# Altium schematic sheet PS_Acelerometro.SchDoc
size A4; SheetNumber: 1; SheetTotal: 1
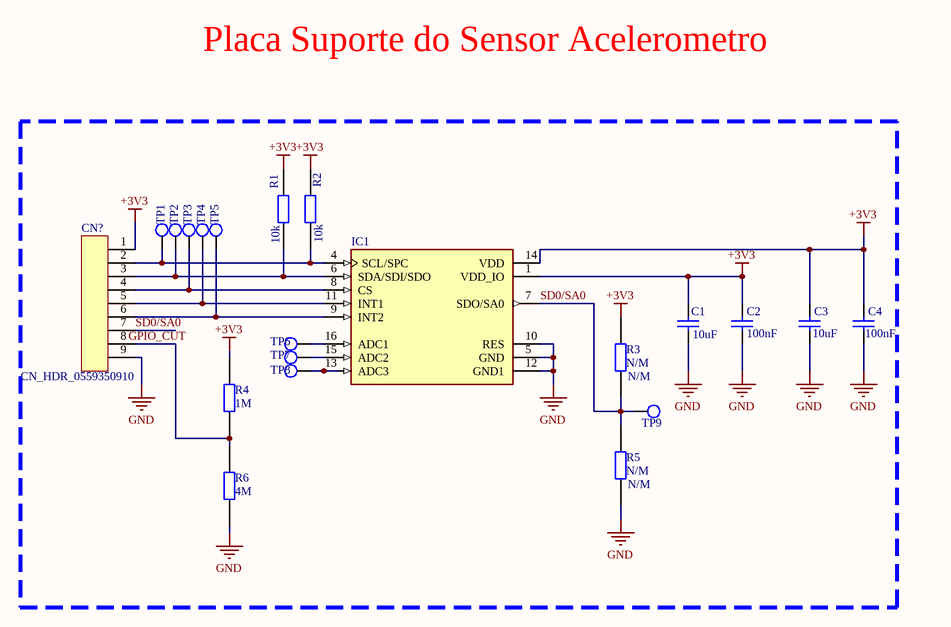
[diagram p0: PS_Acelerometro.SchDoc]

## Parts
C1  10uF  [CSMD-0603]
C2  100nF  [CSMD-0603]
C3  10uF  [CSMD-0603]
C4  100nF  [CSMD-0603]
CN?  CN_HDR_0559350910  [CN_HDR_0559350910]
IC1  CI_LIS3DH_Acelerometro  [PQFN50P300X300X100-16N]  (value not drawn)
R1  10k  [SMD-0603]
R2  10k  [SMD-0603]
R3  N/M  [SMD-0603]
R4  1M  [SMD-0603]
R5  N/M  [SMD-0603]
R6  4M  [SMD-0603]
TP1  VALUE  [TP_0.8_SMD]  (value not drawn)
TP2  VALUE  [TP_0.8_SMD]  (value not drawn)
TP3  VALUE  [TP_0.8_SMD]  (value not drawn)
TP4  VALUE  [TP_0.8_SMD]  (value not drawn)
TP5  VALUE  [TP_0.8_SMD]  (value not drawn)
TP6  VALUE  [TP_0.8_SMD]  (value not drawn)
TP7  VALUE  [TP_0.8_SMD]  (value not drawn)
TP8  VALUE  [TP_0.8_SMD]  (value not drawn)
TP9  VALUE  [TP_0.8_SMD]  (value not drawn)

## Nets
+3V3: C1.2 C2.2 C3.2 C4.2 CN?.1 IC1.1(VDD_IO) IC1.14(VDD) R1.1 R2.1 R3.1 R4.1
GND: C1.1 C2.1 C3.1 C4.1 CN?.9 IC1.5(GND) IC1.10(RES) IC1.12(GND1) R5.2 R6.2
SD0/SA0: CN?.7 IC1.7(SDO/SA0) R3.2 R5.1 TP9.1
NetCN?_2: CN?.2 IC1.4(SCL/SPC) R2.2 TP1.1
NetCN?_3: CN?.3 IC1.6(SDA/SDI/SDO) R1.2 TP2.1
NetCN?_4: CN?.4 IC1.8(CS) TP3.1
NetCN?_5: CN?.5 IC1.11(INT1) TP4.1
NetCN?_6: CN?.6 IC1.9(INT2) TP5.1
NetCN?_8: CN?.8 R4.2 R6.1
NetIC1_13: IC1.13(ADC3) TP8.1
NetIC1_15: IC1.15(ADC2) TP7.1
NetIC1_16: IC1.16(ADC1) TP6.1

## Notes on the sheet
- Placa Suporte do Sensor Acelerometro
- Labels drawn without touching a wire or pin: GPIO_CUT

## Library data of the parts
C1-C4 = Cap SMD: Capacitor SMD; Fabricante: *; MPN: *; Footprint: smd
  C1 C3: value: 10uF
  C2 C4: value: 100nF
R1 R2 = RES_10K_1/10W_0603: RES SMD; Potência: 1/10W; MPN: *; Footprint: 0603; Fabricante: *; value: 10k
R3 R5 = RES_SMD: RES SMD; MPN: *; Footprint: *; Fabricante: *; value: N/M; OBS: N/M
R4 R6 = RES_54K9_1/10W_0603: RES SMD; Potência: 1/10W; MPN: *; Footprint: 0603; Fabricante: *; Supplier 1: Digi-Key; Supplier Part Number 1: 311-54.9KHRCT-ND
  R4: Value: 1M
  R6: Value: 4M
TP1-TP9 = PONTO DE TESTE: PART NUMBER: PARTNUMBER; VALUE: VALUE